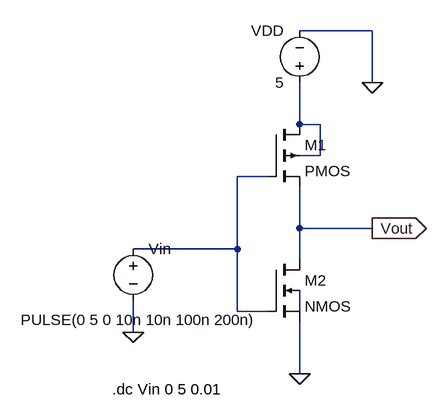
[diagram p0: schematic cmos_inverter.asc]
cmos_inverter.asc, the LTspice schematic file:
Version 4.1
SHEET 1 880 680
WIRE 352 -208 240 -208
WIRE 352 -128 352 -208
WIRE 240 -64 240 -128
WIRE 272 -64 240 -64
WIRE 272 -16 272 -64
WIRE 272 -16 240 -16
WIRE 192 16 144 16
WIRE 240 96 240 32
WIRE 352 96 240 96
WIRE 144 128 144 16
WIRE 144 128 -16 128
WIRE 240 144 240 96
WIRE 144 224 144 128
WIRE 192 224 144 224
WIRE 240 224 240 192
WIRE -16 256 -16 208
WIRE 240 320 240 240
FLAG 352 -128 0
FLAG -16 256 0
FLAG 240 320 0
FLAG 352 96 Vout
IOPIN 352 96 Out
SYMBOL voltage -16 112 R0
WINDOW 3 -173 125 Left 2
WINDOW 123 0 0 Left 0
WINDOW 39 0 0 Left 0
SYMATTR InstName Vin
SYMATTR Value PULSE(0 5 0 10n 10n 100n 200n)
SYMBOL voltage 240 -112 R180
WINDOW 0 24 96 Left 2
WINDOW 3 24 16 Left 2
WINDOW 123 0 0 Left 0
WINDOW 39 0 0 Left 0
SYMATTR InstName VDD
SYMATTR Value 5
SYMBOL pmos4 192 -64 R0
SYMATTR InstName M1
SYMATTR Value2 l=1u w=10u
SYMBOL nmos4 192 144 R0
SYMATTR InstName M2
SYMATTR Value2 l=1u w=5u
TEXT -48 344 Left 2 !.dc Vin 0 5 0.01

The netlist it stands for:
* cmos_inverter.asc
Vin N002 0 PULSE(0 5 0 10n 10n 100n 200n)
VDD N001 0 5
M1 N001 N002 Vout N001 PMOS l=1u w=10u
M2 Vout N002 0 N003 NMOS l=1u w=5u
.model NMOS NMOS
.model PMOS PMOS
.lib standard.mos
.dc Vin 0 5 0.01
.backanno
.end